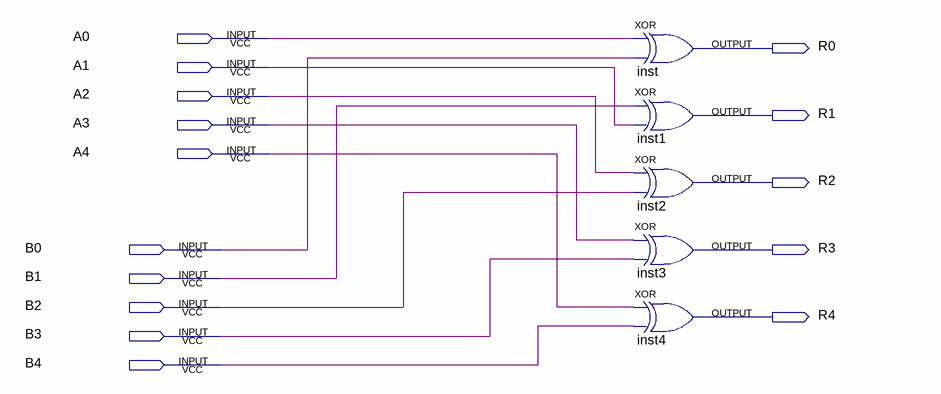
[diagram p0: schematic sheet]
// Quartus schematic sdProject_Xor.bdf as structural Verilog: 5 symbols, 15 pins
module sdProject_Xor (
  input  A0,
  input  A1,
  input  A2,
  input  A3,
  input  A4,
  input  B0,
  input  B1,
  input  B2,
  input  B3,
  input  B4,
  output R0,
  output R1,
  output R2,
  output R3,
  output R4
);

  xor inst (R0, A0, B0);
  xor inst1 (R1, B1, A1);
  xor inst2 (R2, A2, B2);
  xor inst3 (R3, A3, B3);
  xor inst4 (R4, A4, B4);
endmodule
